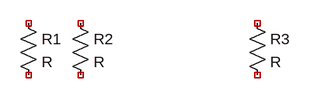
[diagram p0: schematic Draft1.asc]
Draft1.asc, the LTspice schematic file:
Version 4
SHEET 1 880 680
SYMBOL res 0 112 R0
SYMATTR InstName R1
SYMBOL res 80 112 R0
SYMATTR InstName R2
SYMBOL res 352 112 R0
SYMATTR InstName R3

The netlist it stands for:
* Draft1.asc
R1 NC_01 NC_02 R
R2 NC_03 NC_04 R
R3 NC_05 NC_06 R
.backanno
.end